# Altium schematic sheet Dual_Holding_Dongle.SchDoc
size 431 x 279 mm; SheetNumber: 1; SheetTotal: 1
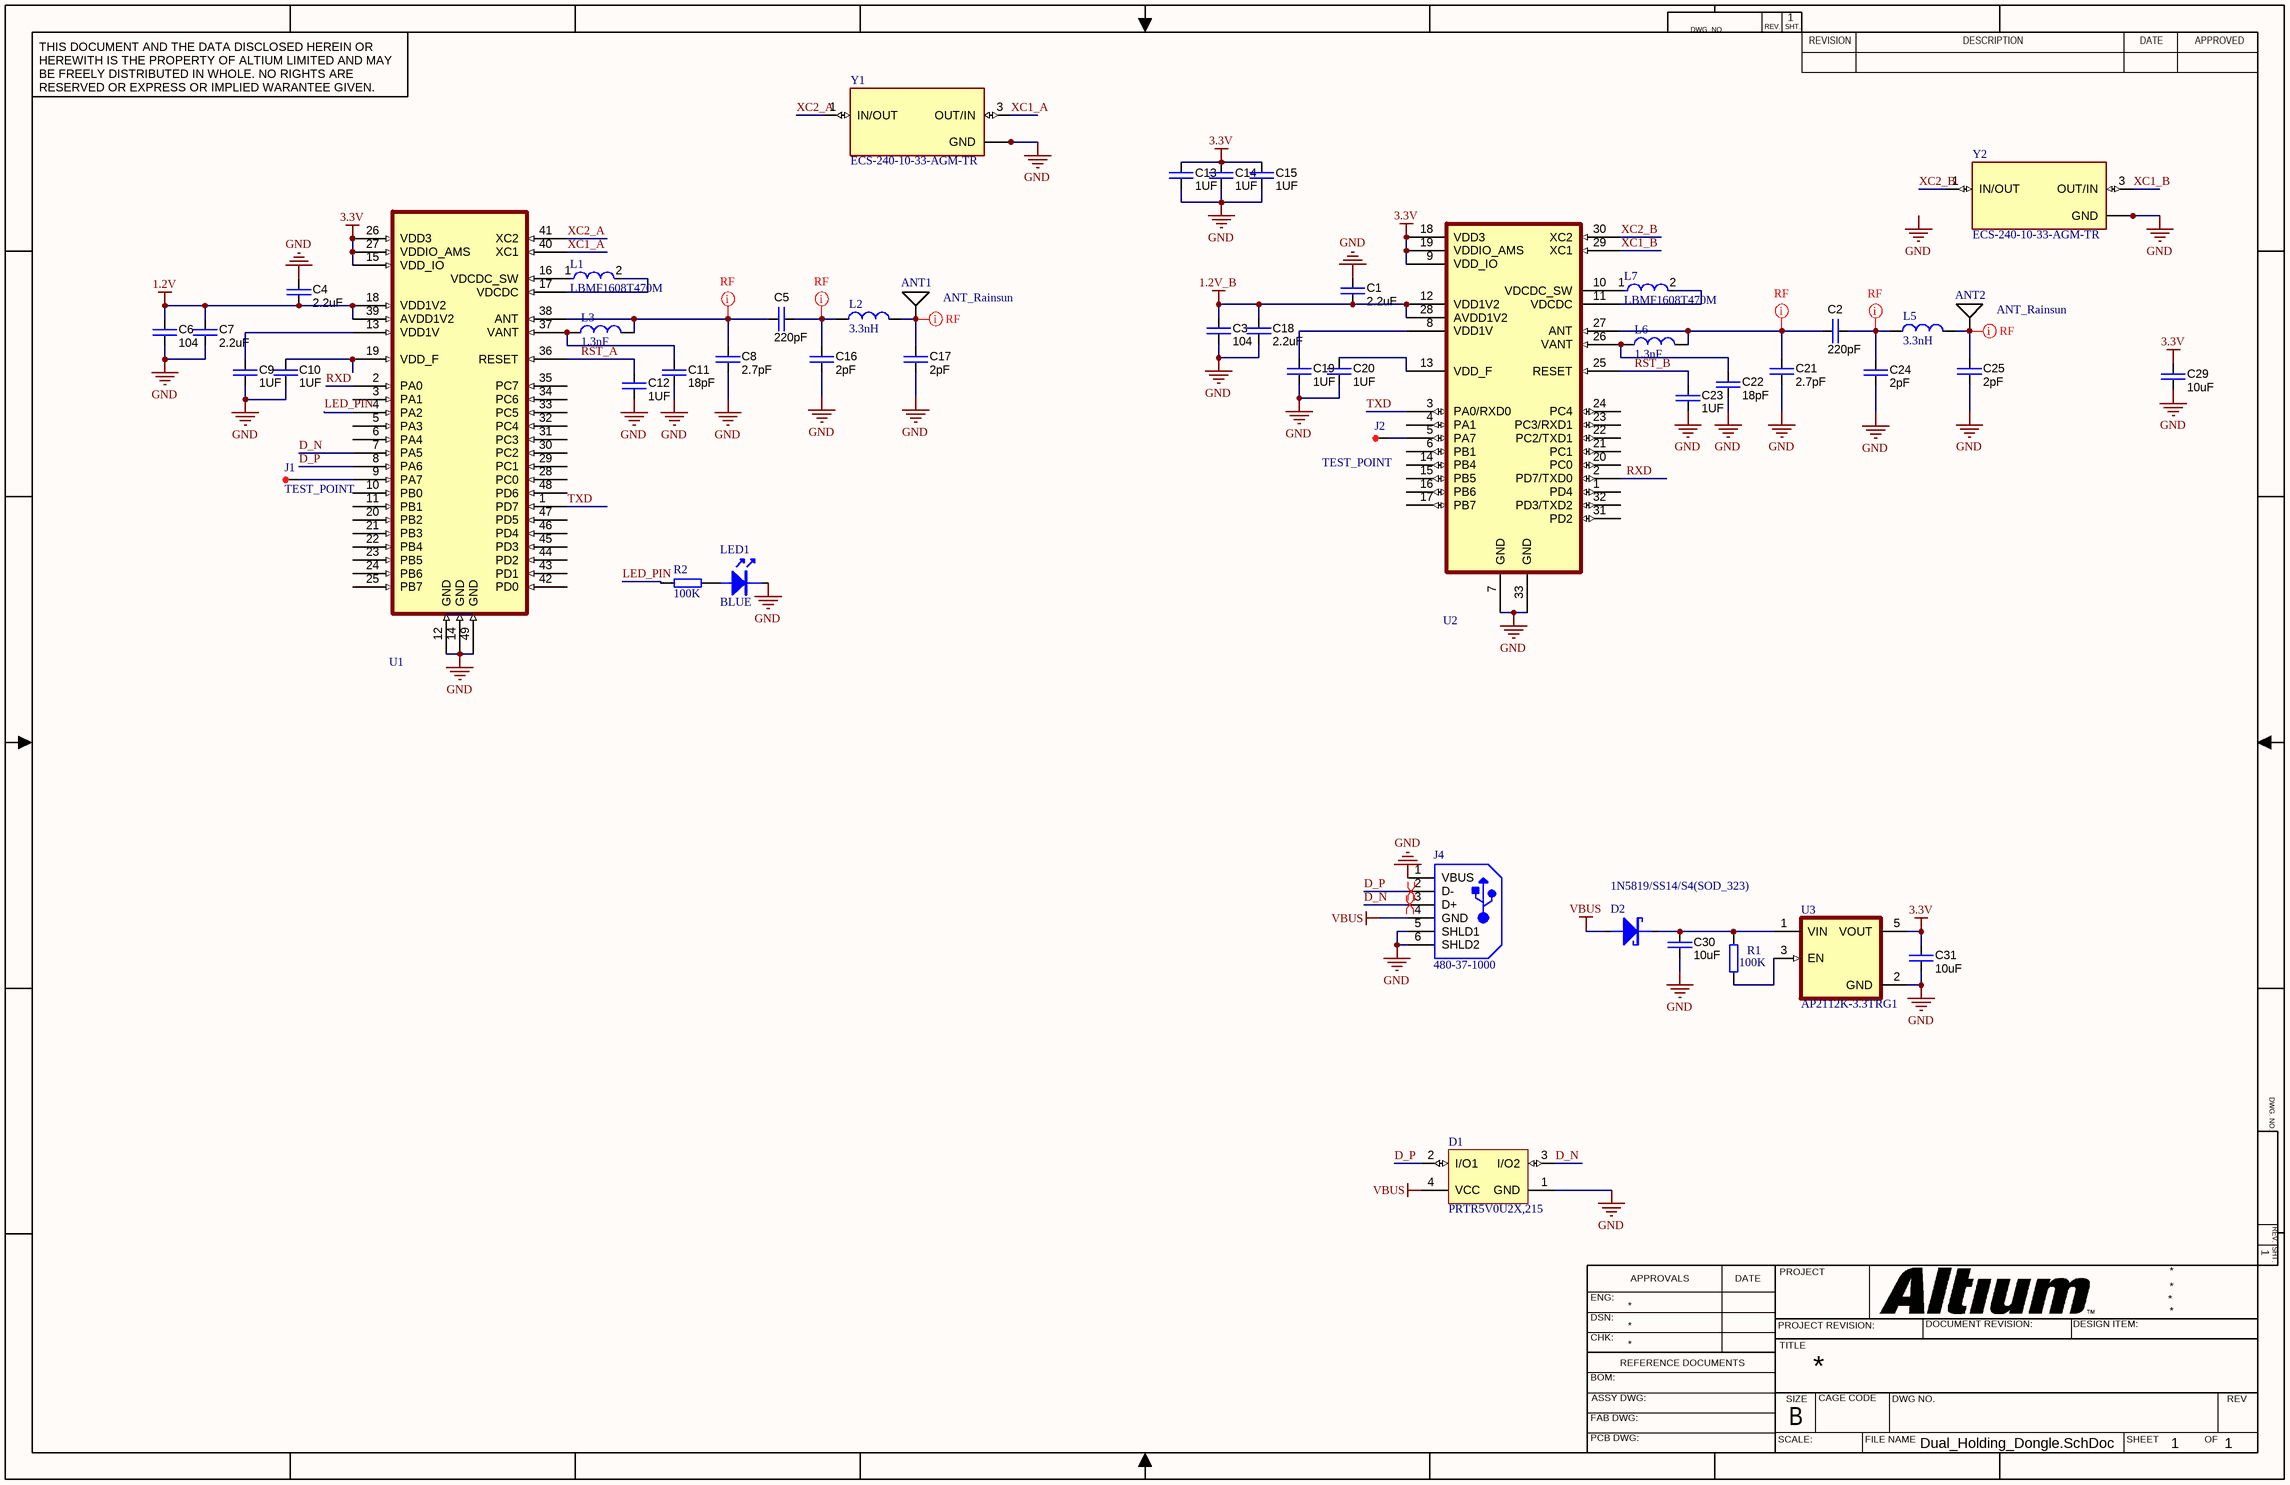
[diagram p0: Dual_Holding_Dongle.SchDoc]

## Parts
ANT1  ANT_Rainsun  [ANT2-SMD-9.5X2.1X1.0MM]
ANT2  ANT_Rainsun  [ANT2-SMD-9.5X2.1X1.0MM]
C1  2.2uF  [CAP0402]
C2  220pF  [CAP0402]
C3  104  [CAP0402]
C4  2.2uF  [CAP0402]
C5  220pF  [CAP0402]
C6  104  [CAP0402]
C7  2.2uF  [CAP0402]
C8  2.7pF  [CAP0402]
C9  1UF  [CAP0402]
C10  1UF  [CAP0402]
C11  18pF  [CAP0402]
C12  1UF  [CAP0402]
C13  1UF  [CAPC1608X90N]
C14  1UF  [CAPC1608X90N]
C15  1UF  [CAPC1608X90N]
C16  2pF  [CAP0402]
C17  2pF  [CAP0402]
C18  2.2uF  [CAP0402]
C19  1UF  [CAP0402]
C20  1UF  [CAP0402]
C21  2.7pF  [CAP0402]
C22  18pF  [CAP0402]
C23  1UF  [CAP0402]
C24  2pF  [CAP0402]
C25  2pF  [CAP0402]
C29  10uF  [CAPC1608X90N]
C30  10uF  [CAPC1608X90N]
C31  10uF  [CAPC1608X90N]
D1  PRTR5V0U2X,215  [NXP-SOT143B-4_V]
D2  1N5819/SS14/S4(SOD_323)  [SMT_DIODE_SOD_323]
J1  TEST_POINT  [TEST_POINT_HOLE_SMALL]
J2  TEST_POINT  [TEST_POINT_HOLE_SMALL]
J4  480-37-1000  [MOLX-480-37-1000_V]
L1  LBMF1608T470M  [FP-LBMF1608-0_8-0_2-IPC_B]
L2  3.3nH  [IND0402]
L3  1.3nF  [IND0402]
L5  3.3nH  [IND0402]
L6  1.3nF  [IND0402]
L7  LBMF1608T470M  [FP-LBMF1608-0_8-0_2-IPC_B]
LED1  BLUE  [SMT_LED_0603]
R1  value 100K  [RES0402]  (hidden comment: Resistor)
R2  value 100K  [RES0402]  (hidden comment: Resistor)
U1  Telink TLSR8251F512ET48  [QFN50P700X700X80_HS-49N]  (value not drawn)
U2  Telink TLSR8251F512ET32  [QFN50P500X500X80_HS-33N2]  (value not drawn)
U3  AP2112K-3.3TRG1  [SOT23-5]
Y1  ECS-240-10-33-AGM-TR  [XTAL_ECS-240-10-33-AGM-TR]
Y2  ECS-240-10-33-AGM-TR  [XTAL_ECS-240-10-33-AGM-TR]

## Nets
1.2V: C4.1 C6.1 C7.1 U1.18(VDD1V2) U1.39(AVDD1V2)
1.2V_B: C1.1 C3.1 C18.1 U2.12(VDD1V2) U2.28(AVDD1V2)
3.3V: C13.1 C14.1 C15.1 C29.1 C31.1 U1.15(VDD_IO) U1.26(VDD3) U1.27(VDDIO_AMS) U2.9(VDD_IO) U2.18(VDD3) U2.19(VDDIO_AMS) U3.5(VOUT)
GND: C1.2 C3.2 C4.2 C6.2 C7.2 C8.2 C9.2 C10.2 C11.1 C12.2 C13.2 C14.2 C15.2 C16.2 C17.2 C18.2 C19.2 C20.2 C21.2 C22.1 C23.2 C24.2 C25.2 C29.2 C30.2 C31.2 D1.1(GND) J4.1(VBUS) J4.5(SHLD1) J4.6(SHLD2) LED1.2(K) U1.12(GND) U1.14(GND) U1.49(GND) U2.7(GND) U2.33(GND) U3.2(GND) Y1.2(GND) Y1.4(GND) Y2.2(GND) Y2.4(GND)
VBUS: D1.4(VCC) D2.1(A) J4.4(GND)
D_N: D1.3(I/O2) J4.3(D+) U1.7(PA5)
D_P: D1.2(I/O1) J4.2(D-) U1.8(PA6)
LED_PIN: R2.1 U1.4(PA2)
RST_A: C12.1 U1.36(RESET)
RST_B: C23.1 U2.25(RESET)
RXD: U1.2(PA0) U2.2(PD7/TXD0)
TXD: U1.1(PD7) U2.3(PA0/RXD0)
XC1_A: U1.40(XC1) Y1.3(OUT/IN)
XC1_B: U2.29(XC1) Y2.3(OUT/IN)
XC2_A: U1.41(XC2) Y1.1(IN/OUT)
XC2_B: U2.30(XC2) Y2.1(IN/OUT)
NetANT1_1: ANT1.1 C17.1 L2.2
NetANT2_1: ANT2.1 C25.1 L5.2
NetC2_1: C2.1 C21.1 L6.2 U2.27(ANT)
NetC2_2: C2.2 C24.1 L5.1
NetC5_1: C5.1 C8.1 L3.2 U1.38(ANT)
NetC5_2: C5.2 C16.1 L2.1
NetC9_1: C9.1 U1.13(VDD1V)
NetC10_1: C10.1 U1.19(VDD_F)
NetC11_2: C11.2 L3.1 U1.37(VANT)
NetC19_1: C19.1 U2.8(VDD1V)
NetC20_1: C20.1 U2.13(VDD_F)
NetC22_2: C22.2 L6.1 U2.26(VANT)
NetC30_1: C30.1 D2.2(K) R1.1 U3.1(VIN)
NetJ1_1: J1.1 U1.9(PA7)
NetJ2_1: J2.1 U2.5(PA7)
NetL1_1: L1.1 U1.16(VDCDC_SW)
NetL1_2: L1.2 U1.17(VDCDC)
NetL7_1: L7.1 U2.10(VDCDC_SW)
NetL7_2: L7.2 U2.11(VDCDC)
NetLED1_1: LED1.1(A) R2.2
NetR1_2: R1.2 U3.3(EN)

Not connected (* = marked no-connect by the designer): U1 3(PA1) 5(PA3) 6(PA4) 10(PB0) 11(PB1) 20(PB2) 21(PB3) 22(PB4) 23(PB5) 24(PB6) 25(PB7) 28(PC0) 29(PC1) 30(PC2) 31(PC3) 32(PC4) 33(PC5) 34(PC6) 35(PC7) 42(PD0) 43(PD1) 44(PD2) 45(PD3) 46(PD4) 47(PD5) 48(PD6); U2 1(PD4) 4(PA1) 6(PB1) 14(PB4) 15(PB5) 16(PB6) 17(PB7) 20(PC0) 21(PC1) 22(PC2/TXD1) 23(PC3/RXD1) 24(PC4) 31(PD2) 32(PD3/TXD2)

## Layout directives
net class RF: NetANT1_1, NetANT2_1, NetC2_1, NetC2_2, NetC5_1, NetC5_2
differential pair: D_N, D_P

## Notes on the sheet
- Labels drawn without touching a wire or pin: GND
- DWG. NO.
- REV.
- SHT.
- THIS DOCUMENT AND THE DATA DISCLOSED HEREIN OR HEREWITH IS THE PROPERTY OF ALTIUM LIMITED AND MAY BE FREELY DISTRIBUTED IN WHOLE. NO RIGHTS ARE RESERVED OR EXPRESS OR IMPLIED WARANTEE GIVEN.
- REVISION
- DESCRIPTION
- DATE
- APPROVED
- ENG:
- APPROVALS
- PROJECT
- DSN:
- CHK:
- REFERENCE DOCUMENTS
- PROJECT REVISION:
- TITLE
- DOCUMENT REVISION:
- DESIGN ITEM:
- BOM:
- FAB DWG:
- PCB DWG:
- ASSY DWG:
- SCALE:
- SIZE
- B
- CAGE CODE
- FILE NAME
- DWG NO.
- SHEET
- OF
- REV

## Library data of the parts
ANT1 ANT2 = ANT_Rainsun: 318010004; MP: AN9520; MF: RainSun; Package: FakePackage u; SnapEDA_Link: https://www.snapeda.com/parts/AN9520/RainSun/view-part/106325/?ref=snap; Price: None; Check_prices: https://www.snapeda.com/parts/AN9520/RainSun/view-part/106325/?ref=eda; Value: *; Availability: No availability data
C1-C25 C29-C31 = CAP C_0603: Capacitor SMD Cer 470nF 10% 16V X7R 0603; Manufacturer 1: Murata Electronics North America; Manufacturer Part Number 1: GRM188R71C474KA88D; Ratings: 16V; X7R; Material: ceramic; SCDType: spec; Package / Case: 0603 (1608 metric); Tolerance: ±10%; Manufacturer 2: TDK Corporation; Manufacturer Part Number 2: C1608X7R1C474K; Supplier 1: Digi-Key; Supplier Part Number 1: 490-3295-2-ND; Supplier 2: Digi-Key; Supplier Part Number 2: 445-5192-2-ND; Supplier 3: Digi-Key; Supplier Part Number 3: 587-1250-2-ND; Manufacturer 3: Taiyo Yuden; Manufacturer Part Number 3: EMK107B7474KA-T; Manufacturer 4: Samsung; Manufacturer Part Number 4: CL10B474KONE; ComponentLink1URL: http://psearch.murata.com/capacitor/product/GRM188R71C474KA88#.pdf; ComponentLink1Description: http://psearch.murata.com/capacitor/product/GRM188R71C474KA88#.pdf; ComponentLink2URL: http://product.tdk.com/capacitor/mlcc/en/documents/mlcc_commercial_general_en.pdf; ComponentLink2Description: http://product.tdk.com/capacitor/mlcc/en/documents/mlcc_commercial_general_en.pdf; ComponentLink3URL: http://www.yuden.co.jp/or/product/category/capacitor/EMK107B7474KA-T.pdf; ComponentLink3Description: http://www.yuden.co.jp/or/product/category/capacitor/EMK107B7474KA-T.pdf
  C1 C4 C7 C18: Value: 2.2uF
  C2 C5: Value: 220pF
  C3 C6: Value: 104
  C8 C21: Value: 2.7pF
  C9 C10 C12-C15 C19 C20 C23: Value: 1UF
  C11 C22: Value: 18pF
  C16 C17 C24 C25: Value: 2pF
  C29-C31: Value: 10uF
D1 = CMP-2000-05285-1: Ultra Low Capacitance Double Rail-to-Rail ESD Protection Diode, 5.5 V, 1 pF, -40 to 85 degC, 4-Pin SOT143B, RoHS, Tape and Reel; Manufacturer: NXP Semiconductors; Capacitance Value: 16pF; Number of Elements: 1; Rad Hardened: No; Reverse Breakdown Voltage: 6V; Working Voltage (Max): 5.5V; Polarity: Uni-Directional; Configuration: Quad; Leakage Current: 0.1uA; Product Height (mm): 1mm; Suppressor Type: DiodeArrays; Product Length (mm): 3mm; Product Depth (mm): 1.4mm; ESD Protection Voltage: 8KV@ContactDisc; Package Type: SOT; Mounting: SurfaceMount; Packaging: TapeandReel; Datasheet Version: Rev. 02, 01/2008; Reverse Stand-off Voltage: 5.5V; Manufacturer URL: http://www.nxp.com/; Operating Temp Range: -40Cto85C; Operating Temperature Classification: Industrial; Working Voltage: 5.5V; Operating Temperature Min Deg. C: -40C; Datasheet URL: https://datasheet.ciiva.com/4479/prtr5v0u2x-102853-4479461.pdf; Leakage Current (Max): 0.1uA; Direction Type: Uni-Directional; Pin Count: 3+Tab; Operating Temperature Max Deg. C: 85C; Mounting Style: SurfaceMount; Package / Case: SOT
D2 = SMT_DIODE_SCHOTTKY_SOD_323: Surface mount schottky diode SOD-323(0805) Package
J4 = CMP-1676-00005-1: Universal Serial Bus (USB) Shielded I/O Plug, Type A, Right Angle Connector, 1.5 A, -20 to 85 degC, 4-Pin SMD, RoHS, Tray; Tolerance: 1%; Power Rating: 100 mW; Voltage Rating: 50 V; Case\Package: 0603; Resistance: 1 mohm; Width: 0.8 mm; Mount: Surface Mount; ComponentLink1URL: http://www.molex.com/; ComponentLink1Description: Manufacturer URL; REACH SVHC: No SVHC; Case Code (Imperial): 0603; Height: 0.45 mm; Max Operating Temperature: 155 degC; ComponentLink2Description: Datasheet; Min Operating Temperature: -55 degC; Length: 1.6 mm; Pins: 2; RoHSCompliant: true; Package Quantity: 5000; DatasheetVersion: Rev. D, 06/2004; PackageDescription: 4-Pin Surface Mount Device, Body 12 x 18.8 mm; Voltage Rating (DC): 50 V; PackageReference: 480-37-1000; Case Code (Metric): 1608; ComponentLink2URL: http://www.molex.com/pdm_docs/sd/480371000_sd.pdf; Packaging: Tape and Reel
L1 L7 = CMP-14484-001230-1: SMD Inductors 47uH ±20% 0.035A 3.25Ω 0603; Test Frequency: 2.52MHz; DC Resistance (DCR): 3.25R; DC Current: 35mA; Core Material: Ferrite; Self Resonant Frequency: 11MHz; Packaging: Tape and Reel; RoHS Compliant: Yes; Max Operating Temperature: 105°C; Min Operating Temperature: -40°C; Radiation Hardening: No; Inductance: 47uH; Depth: 0.9mm; Tolerance: 20%; Lead Free: Lead Free; Halogen Free: Halogen Free; Length: 1.7mm; Case/Package: 0603; Military Standard: Not
L2 L3 L5 L6 = Inductor: Value: 150 mH
LED1 = SMT_LED_0603: SMT LED
R1 R2 = RES-SM-0603-10K: RES SM 0603 10K; Supplier 1: Farnell; Supplier 2: Digi-Key; Supplier Part Number 1: 9330399; Supplier Part Number 2: 541-10.0KHCT-ND
U3 = AP2112K-3.3TRG1: Linear Voltage Regulator IC 1 Output 600mA SOT-25; MF: Diodes Inc.; Digi-Key_Part_Number: AP2112K-3.3TRG1DICT-ND; SnapEDA_Link: https://www.snapeda.com/parts/AP2112K-3.3TRG1/Diodes%20Inc./view-part/454988/?ref=snap; Package: SOT-753 Diodes Inc.; MP: AP2112K-3.3TRG1; Value: *; Digi-Key_Purchase_URL: https://www.digikey.com.au/product-detail/en/diodes-incorporated/AP2112K-3.3TRG1/AP2112K-3.3TRG1DICT-ND/4505257?utm_source=snapeda&utm_medium=aggregator&utm_campaign=symbol
Y1 Y2 = ECS-240-10-33-AGM-TR: Package: None; Price: None; Value: *; MP: ECS-240-10-33-AGM-TR; Availability: Unavailable